# Altium schematic sheet Fly.SchDoc
size A4
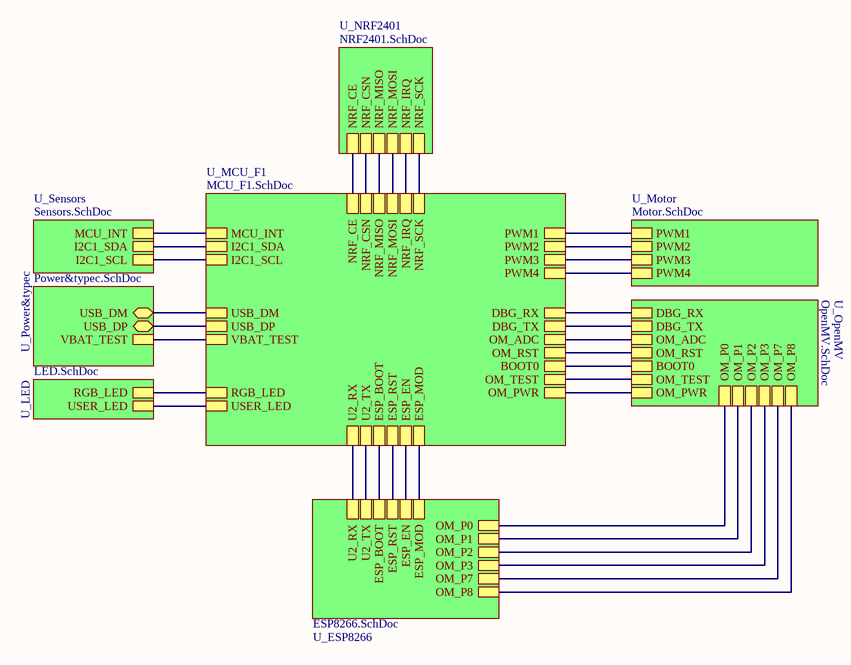
[diagram p0: Fly.SchDoc]

## Sub-sheets
U_ESP8266 = ESP8266.SchDoc: OM_P0, OM_P1, OM_P2, OM_P3, OM_P7, OM_P8, U2_RX, U2_TX, ESP_BOOT, ESP_RST, ESP_EN, ESP_MOD
U_LED = LED.SchDoc: RGB_LED, USER_LED
U_MCU_F1 = MCU_F1.SchDoc: OM_PWR, OM_TEST, OM_RST, VBAT_TEST, OM_ADC, U2_TX, USB_DP, USB_DM, DBG_RX, DBG_TX, NRF_CE, NRF_MOSI, NRF_MISO, NRF_SCK, NRF_CSN, U2_RX, ESP_EN, ESP_BOOT, PWM1, PWM2, PWM3, PWM4, NRF_IRQ, RGB_LED, USER_LED, BOOT0, I2C1_SDA, I2C1_SCL, ESP_RST, MCU_INT, ESP_MOD
U_Motor = Motor.SchDoc: PWM1, PWM2, PWM4, PWM3
U_NRF2401 = NRF2401.SchDoc: NRF_CE, NRF_CSN, NRF_MISO, NRF_MOSI, NRF_IRQ, NRF_SCK
U_OpenMV = OpenMV.SchDoc: OM_P8, OM_P7, OM_P0, OM_P1, OM_P2, OM_P3, DBG_RX, DBG_TX, OM_ADC, OM_RST, BOOT0, OM_TEST, OM_PWR
U_Power&typec = Power&typec.SchDoc: VBAT_TEST, USB_DM, USB_DP
U_Sensors = Sensors.SchDoc: MCU_INT, I2C1_SCL, I2C1_SDA

## Nets
(unnamed): sheet U_Power&typec/VBAT_TEST, sheet U_MCU_F1/VBAT_TEST
(unnamed): sheet U_Power&typec/USB_DM, sheet U_MCU_F1/USB_DM
(unnamed): sheet U_Power&typec/USB_DP, sheet U_MCU_F1/USB_DP
(unnamed): sheet U_LED/RGB_LED, sheet U_MCU_F1/RGB_LED
(unnamed): sheet U_LED/USER_LED, sheet U_MCU_F1/USER_LED
(unnamed): sheet U_Sensors/MCU_INT, sheet U_MCU_F1/MCU_INT
(unnamed): sheet U_Sensors/I2C1_SCL, sheet U_MCU_F1/I2C1_SCL
(unnamed): sheet U_Sensors/I2C1_SDA, sheet U_MCU_F1/I2C1_SDA
(unnamed): sheet U_NRF2401/NRF_CE, sheet U_MCU_F1/NRF_CE
(unnamed): sheet U_NRF2401/NRF_CSN, sheet U_MCU_F1/NRF_CSN
(unnamed): sheet U_NRF2401/NRF_MISO, sheet U_MCU_F1/NRF_MISO
(unnamed): sheet U_NRF2401/NRF_MOSI, sheet U_MCU_F1/NRF_MOSI
(unnamed): sheet U_NRF2401/NRF_IRQ, sheet U_MCU_F1/NRF_IRQ
(unnamed): sheet U_NRF2401/NRF_SCK, sheet U_MCU_F1/NRF_SCK
(unnamed): sheet U_OpenMV/OM_P8, sheet U_ESP8266/OM_P8
(unnamed): sheet U_OpenMV/OM_P7, sheet U_ESP8266/OM_P7
(unnamed): sheet U_OpenMV/OM_P0, sheet U_ESP8266/OM_P0
(unnamed): sheet U_OpenMV/OM_P1, sheet U_ESP8266/OM_P1
(unnamed): sheet U_OpenMV/OM_P2, sheet U_ESP8266/OM_P2
(unnamed): sheet U_OpenMV/OM_P3, sheet U_ESP8266/OM_P3
(unnamed): sheet U_OpenMV/DBG_RX, sheet U_MCU_F1/DBG_RX
(unnamed): sheet U_OpenMV/DBG_TX, sheet U_MCU_F1/DBG_TX
(unnamed): sheet U_OpenMV/OM_ADC, sheet U_MCU_F1/OM_ADC
(unnamed): sheet U_OpenMV/OM_RST, sheet U_MCU_F1/OM_RST
(unnamed): sheet U_OpenMV/BOOT0, sheet U_MCU_F1/BOOT0
(unnamed): sheet U_OpenMV/OM_TEST, sheet U_MCU_F1/OM_TEST
(unnamed): sheet U_OpenMV/OM_PWR, sheet U_MCU_F1/OM_PWR
(unnamed): sheet U_Motor/PWM1, sheet U_MCU_F1/PWM1
(unnamed): sheet U_Motor/PWM2, sheet U_MCU_F1/PWM2
(unnamed): sheet U_Motor/PWM4, sheet U_MCU_F1/PWM4
(unnamed): sheet U_Motor/PWM3, sheet U_MCU_F1/PWM3
(unnamed): sheet U_ESP8266/U2_RX, sheet U_MCU_F1/U2_RX
(unnamed): sheet U_ESP8266/U2_TX, sheet U_MCU_F1/U2_TX
(unnamed): sheet U_ESP8266/ESP_BOOT, sheet U_MCU_F1/ESP_BOOT
(unnamed): sheet U_ESP8266/ESP_RST, sheet U_MCU_F1/ESP_RST
(unnamed): sheet U_ESP8266/ESP_EN, sheet U_MCU_F1/ESP_EN
(unnamed): sheet U_ESP8266/ESP_MOD, sheet U_MCU_F1/ESP_MOD